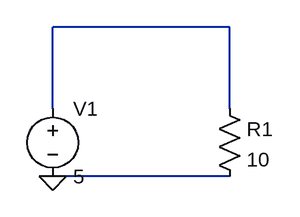
[diagram p0: schematic circuit.asc]
circuit.asc, the LTspice schematic file:
Version 4
SHEET 1 880 680
WIRE 256 32 48 32
WIRE 48 128 48 32
WIRE 256 128 256 32
WIRE 256 208 48 208
FLAG 48 208 0
SYMBOL voltage 48 112 R0
WINDOW 123 0 0 Left 0
WINDOW 39 0 0 Left 0
SYMATTR InstName V1
SYMATTR Value 5
SYMBOL res 240 112 R0
SYMATTR InstName R1
SYMATTR Value 10

The netlist it stands for:
* circuit.asc
V1 N001 0 5
R1 N001 0 10
.backanno
.end